# Altium project LowerPlumbingBayBoard.PrjPcb
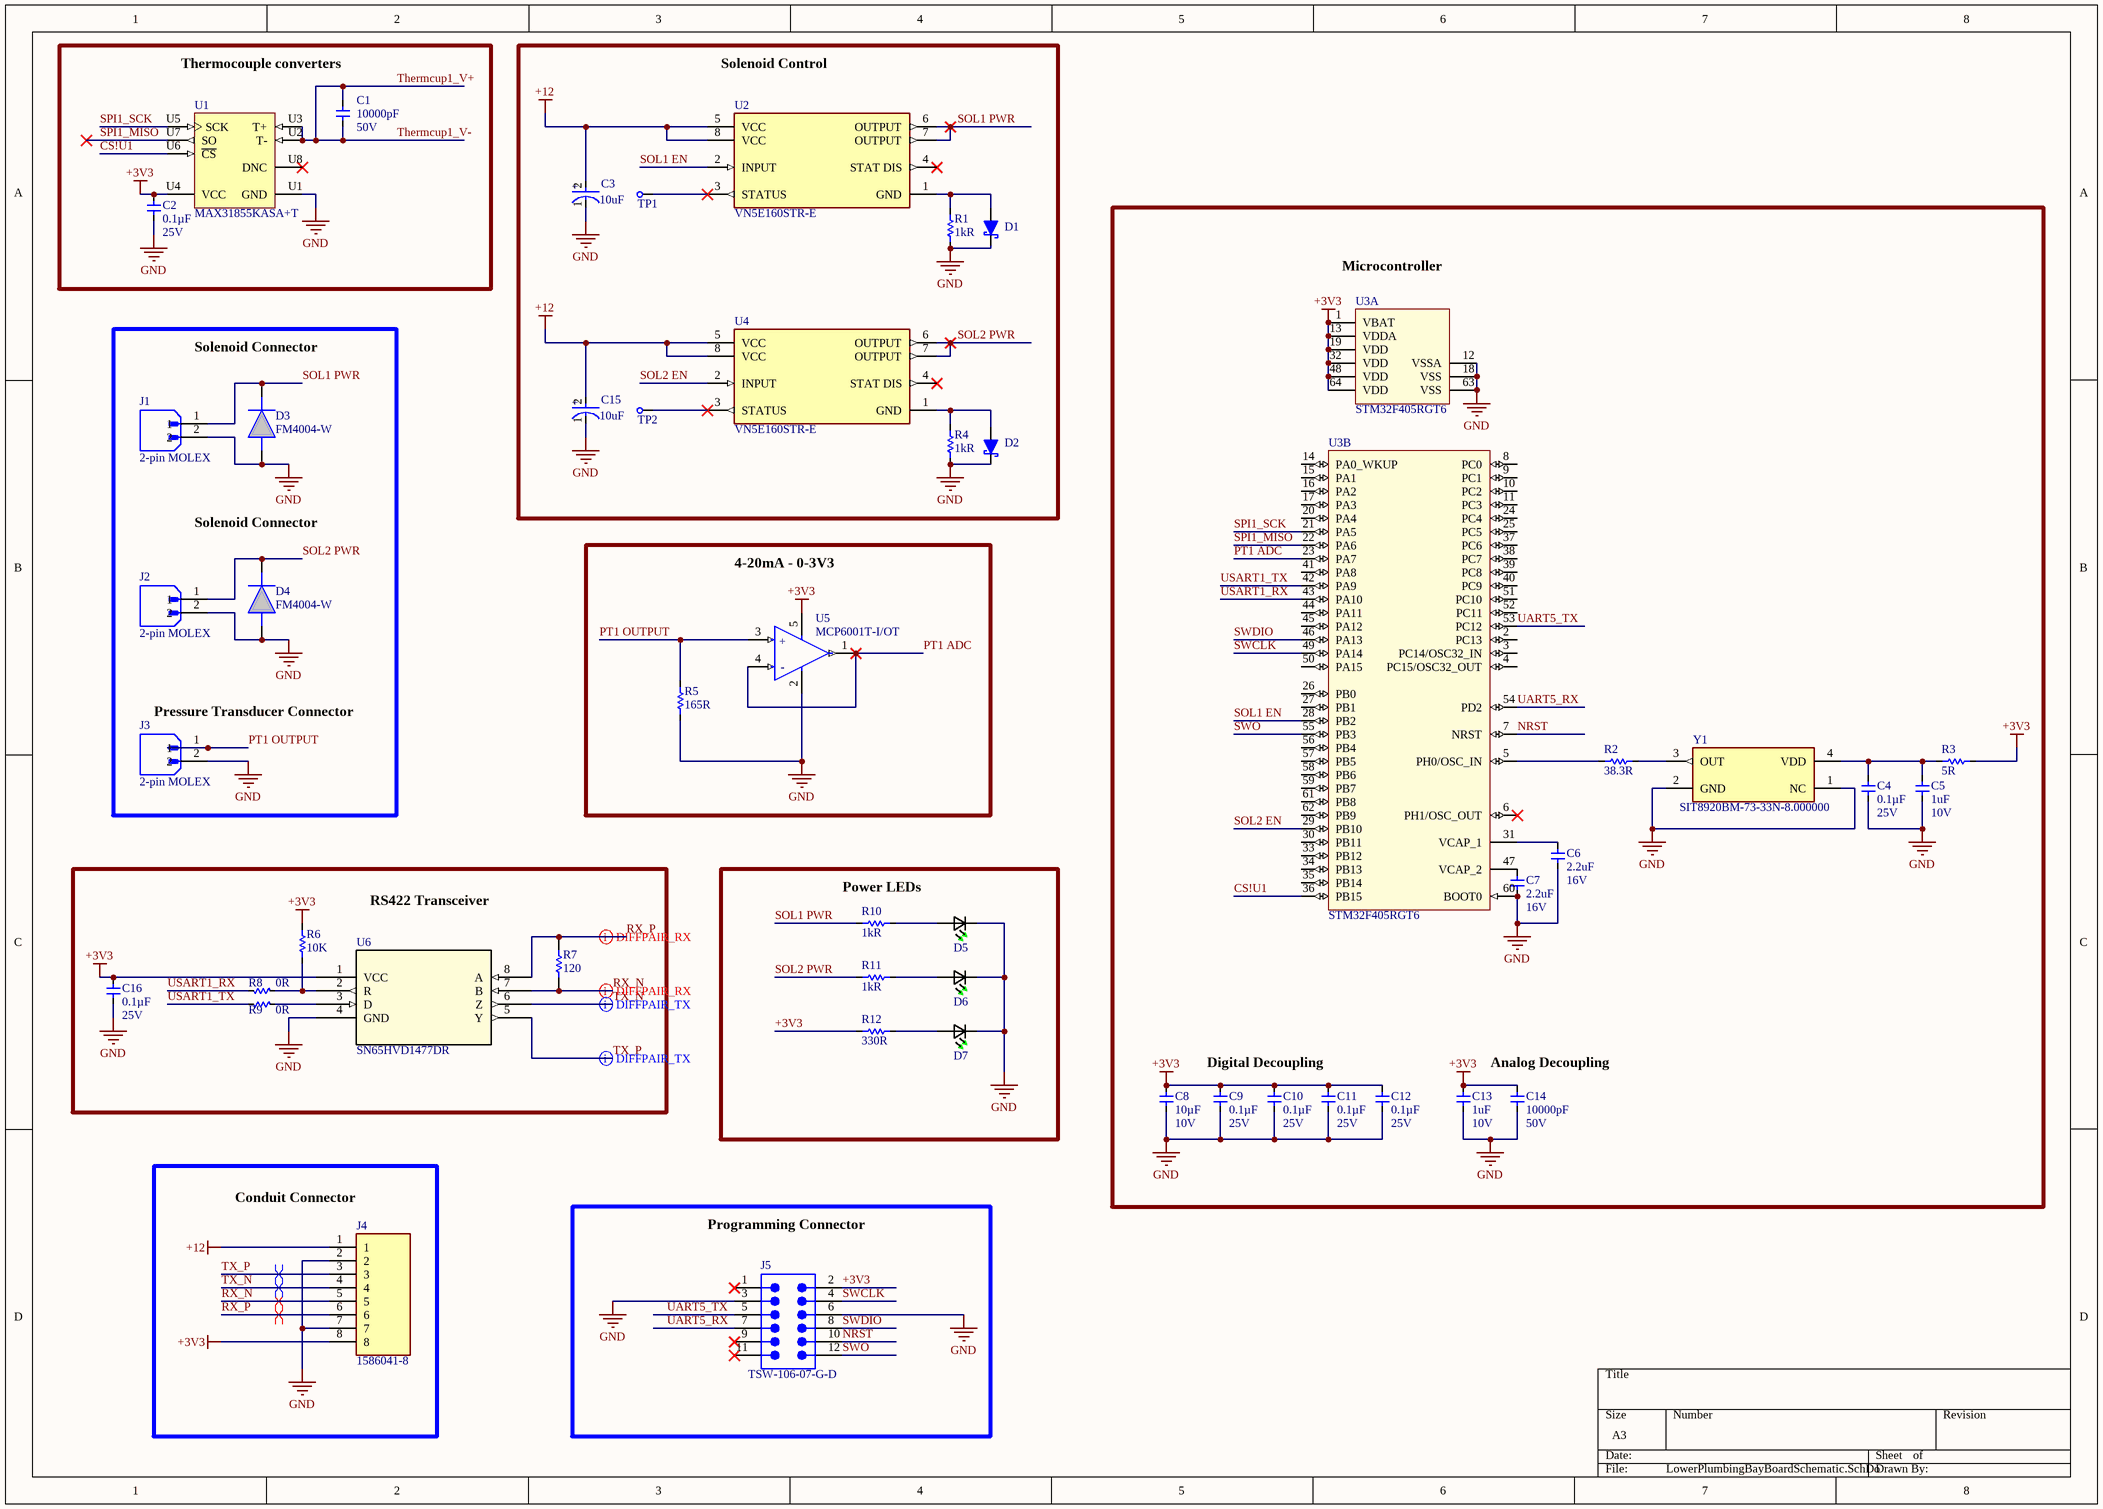
[diagram p0: LowerPlumbingBayBoardSchematic.SchDoc]
1 sheet, 49 parts. Net scope: global (net labels, ports and power ports of the same name join across sheets).
Board file: LowerPlumbingBayBoardPCB.PcbDoc

## Sheet LowerPlumbingBayBoardSchematic.SchDoc
size A3; SheetNumber: 1; SheetTotal: 1

### Parts
C1  Capacitance: 10000pF  Voltage - Rated: 50V  [10000pF-CAP_1608_TDK]  (hidden comment: CGA3E2X7R1H103K080AA)
C2  Capacitance: 0.1µF  Voltage - Rated: 25V  [0.1uF-FP-CGA3E-0_3-0_1-IPC_A]  (hidden comment: CGA3E2X7R1E104K080AA)
C3  Capacitance: 10uF  [FP-TAJB-MFG]  (hidden comment: TAJB106K025RNJ)
C4  Capacitance: 0.1µF  Voltage - Rated: 25V  [0603[1608]]  (hidden comment: CGA3E2X7R1E104K080AA)
C5  Capacitance: 1uF  Voltage - Rated: 10V  [0603[1608]]  (hidden comment: CL10A105KP8NNNC)
C6  Capacitance: 2.2uF  Voltage - Rated: 16V  [0603]  (hidden comment: C1608X5R1C225K080AB)
C7  Capacitance: 2.2uF  Voltage - Rated: 16V  [0603]  (hidden comment: C1608X5R1C225K080AB)
C8  Capacitance: 10µF  Voltage - Rated: 10V  [10uF-FP-CL10-IPC_B]  (hidden comment: CL10A106MP8NNNC)
C9  Capacitance: 0.1µF  Voltage - Rated: 25V  [0.1uF-FP-CGA3E-0_3-0_1-IPC_A]  (hidden comment: CGA3E2X7R1E104K080AA)
C10  Capacitance: 0.1µF  Voltage - Rated: 25V  [0.1uF-FP-CGA3E-0_3-0_1-IPC_A]  (hidden comment: CGA3E2X7R1E104K080AA)
C11  Capacitance: 0.1µF  Voltage - Rated: 25V  [0.1uF-FP-CGA3E-0_3-0_1-IPC_A]  (hidden comment: CGA3E2X7R1E104K080AA)
C12  Capacitance: 0.1µF  Voltage - Rated: 25V  [0.1uF-FP-CGA3E-0_3-0_1-IPC_A]  (hidden comment: CGA3E2X7R1E104K080AA)
C13  Capacitance: 1uF  Voltage - Rated: 10V  [1uF-FP-CL10-IPC_B]  (hidden comment: CL10A105KP8NNNC)
C14  Capacitance: 10000pF  Voltage - Rated: 50V  [10000pF-CAP_1608_TDK]  (hidden comment: CGA3E2X7R1H103K080AA)
C15  Capacitance: 10uF  [FP-TAJB-MFG]  (hidden comment: TAJB106K025RNJ)
C16  Capacitance: 0.1µF  Voltage - Rated: 25V  [0603]  (hidden comment: CGA3E2X7R1E104K080AA)
D1  B330A-13-F  [B330A-13-F]  (value not drawn)
D2  B330A-13-F  [B330A-13-F]  (value not drawn)
D3  FM4004-W  [DIONM5025X231N]
D4  FM4004-W  [DIONM5025X231N]
D5  LTST-C191KGKT  [LTST-C191KGKT]  (value not drawn)
D6  LTST-C191KGKT  [LTST-C191KGKT]  (value not drawn)
D7  LTST-C191KGKT  [LTST-C191KGKT]  (value not drawn)
J1  2-pin MOLEX  [MOLEX_436500227]
J2  2-pin MOLEX  [MOLEX_436500227]
J3  2-pin MOLEX  [MOLEX_436500227]
J4  1586041-8  [TE_1586041-8]
J5  TSW-106-07-G-D  [SMTC-TSW-106-07-X-D]
R1  Resistance: 1kR  [0603 - duplicate]  (hidden comment: RC0603FR-071KL)
R2  Resistance: 38.3R  [0603]  (hidden comment: ERJ-3EKF38R3V)
R3  Resistance: 5R  [BO_PWR2010]  (hidden comment: PWR2010W5R00JE)
R4  Resistance: 1kR  [0603 - duplicate]  (hidden comment: RC0603FR-071KL)
R5  Resistance: 165R  [0603]  (hidden comment: ERJ-3GEYJ103V)
R6  Resistance: 10K  [0603]  (hidden comment: ERJ-3GEYJ103V)
R7  120  [120ohm_RESC1608X55X30NL15T15]
R8  0R  [0603]
R9  0R  [0603]
R10  Resistance: 1kR  [0603 - duplicate]  (hidden comment: RC0603FR-071KL)
R11  Resistance: 1kR  [0603 - duplicate]  (hidden comment: RC0603FR-071KL)
R12  Resistance: 330R  [0603 - duplicate]  (hidden comment: CRGCQ0402J330R)
TP1  Testpoint  [Testpoint]  (value not drawn)  (no BOM)
TP2  Testpoint  [Testpoint]  (value not drawn)  (no BOM)
U1  MAX31855KASA+T  [MAXM-S8+4_L]
U2  VN5E160STR-E  [FP-SO-8-0016023-MFG]
U3  STM32F405RGT6  [STM-LQFP64_L]  (parts A,B of 2)
U4  VN5E160STR-E  [FP-SO-8-0016023-MFG]
U5  MCP6001T-I/OT  [FP-C04-091-OT-IPC_A]
U6  SN65HVD1477DR  [D8_TEX]
Y1  SIT8920BM-73-33N-8.000000  [FP-SIT8920BM-73-33N-8_000-MFG]

### Blocks framed on the sheet
Thermocouple converters: C1 C2 U1
Solenoid Control: C3 C15 D1 D2 R1 R4 TP1 TP2 U2 U4
4-20mA - 0-3V3: R5 U5
RS422 Transceiver: C16 R6-R9 U6
Power LEDs: D5-D7 R10-R12
Conduit Connector: J4
Programming Connector: J5

### Nets
+3V3: C2.1 C8.1 C9.1 C10.1 C11.1 C12.1 C13.1 C14.1 C16.1 J4.8 J5.2 R3.2 R6.2 R12.1 U1.U4(VCC) U3.1(VBAT) U3.13(VDDA) U3.19(VDD) U3.32(VDD) U3.48(VDD) U3.64(VDD) U5.5(VDD) U6.1(VCC)
+12: C3.2(A) C15.2(A) J4.1 U2.5(VCC) U2.8(VCC) U4.5(VCC) U4.8(VCC)
GND: C2.2 C3.1(C) C4.1 C5.1 C6.1 C7.2 C8.2 C9.2 C10.2 C11.2 C12.2 C13.2 C14.2 C15.1(C) C16.2 D1.2 D2.2 D3.2(A) D4.2(A) D5.1(K2) D6.1(K2) D7.1(K2) J1.2 J2.2 J3.2 J4.2 J4.7 J5.3 J5.6 R1.1 R4.1 R5.1 U1.U1(GND) U3.12(VSSA) U3.18(VSS) U3.60(BOOT0) U3.63(VSS) U5.2(VSS) U6.4(GND) Y1.1(NC) Y1.2(GND)
CS!U1: U1.U6(~{CS}) U3.36(PB15)
NRST: J5.10 U3.7(NRST)
PT1 ADC: U3.23(PA7) U5.1(VOUT) U5.4(VIN-)
PT1 OUTPUT: J3.1 R5.2 U5.3(VIN+)
RX_N: J4.5 R7.1 U6.7(B)
RX_P: J4.6 R7.2 U6.8(A)
SOL1 EN: U2.2(INPUT) U3.28(PB2)
SOL1 PWR: D3.1(K) J1.1 R10.1 U2.6(OUTPUT) U2.7(OUTPUT)
SOL2 EN: U3.29(PB10) U4.2(INPUT)
SOL2 PWR: D4.1(K) J2.1 R11.1 U4.6(OUTPUT) U4.7(OUTPUT)
SPI1_MISO: U1.U7(SO) U3.22(PA6)
SPI1_SCK: U1.U5(SCK) U3.21(PA5)
SWCLK: J5.4 U3.49(PA14)
SWDIO: J5.8 U3.46(PA13)
SWO: J5.12 U3.55(PB3)
Thermcup1_V+: C1.1 C1.2 U1.U2(T-) U1.U3(T+)  [also labelled Thermcup1_V-]
TX_N: J4.4 U6.6(Z)
TX_P: J4.3 U6.5(Y)
UART5_RX: J5.7 U3.54(PD2)
UART5_TX: J5.5 U3.53(PC12)
USART1_RX: R8.1 U3.43(PA10)
USART1_TX: R9.1 U3.42(PA9)
NetC4_2: C4.2 C5.2 R3.1 Y1.4(VDD)
NetC6_2: C6.2 U3.31(VCAP_1)
NetC7_1: C7.1 U3.47(VCAP_2)
NetD1_1: D1.1 R1.2 U2.1(GND)
NetD2_1: D2.1 R4.2 U4.1(GND)
NetD5_2: D5.2(A2) R10.2
NetD6_2: D6.2(A2) R11.2
NetD7_2: D7.2(A2) R12.2
NetR2_1: R2.1 U3.5(PH0/OSC_IN)
NetR2_2: R2.2 Y1.3(OUT)
NetR6_1: R6.1 R8.2 U6.2(R)
NetR9_2: R9.2 U6.3(D)
NetTP1_1: TP1.1 U2.3(STATUS)
NetTP2_1: TP2.1 U4.3(STATUS)

Not connected (* = marked no-connect by the designer): J5 1* 9* 11*; U1 U8(DNC)*; U2 4(STAT_DIS)*; U3 2(PC13) 3(PC14/OSC32_IN) 4(PC15/OSC32_OUT) 6(PH1/OSC_OUT)* 8(PC0) 9(PC1) 10(PC2) 11(PC3) 14(PA0_WKUP) 15(PA1) 16(PA2) 17(PA3) 20(PA4) 24(PC4) 25(PC5) 26(PB0) 27(PB1) 30(PB11) 33(PB12) 34(PB13) 35(PB14) 37(PC6) 38(PC7) 39(PC8) 40(PC9) 41(PA8) 44(PA11) 45(PA12) 50(PA15) 51(PC10) 52(PC11) 56(PB4) 57(PB5) 58(PB6) 59(PB7) 61(PB8) 62(PB9); U4 4(STAT_DIS)*

### Layout directives
differential pair: RX_N, RX_P, TX_N, TX_P

### Notes on the sheet
- (near U3) Microcontroller
- (near D3) Solenoid Connector
- Solenoid Connector
- (near J3) Pressure Transducer Connector
- (near R6) May need a termination resistor for reciver (need to match wires impedence)
- Digital Decoupling
- Analog Decoupling
- (in symbol CMP-0187-00462-3) +; -
- (in symbol CMP-04424-000481-1) +

### Library data of the parts
C1 C14 = CGA3E2X7R1H103K080AA: CAP CER 10000PF 50V X7R 0603; Manufacturer: TDK Corporation; Tolerance: ±10%; Temperature Coefficient: X7R; Operating Temperature: -55°C ~ 125°C; Mounting Type: Surface Mount, MLCC; Package / Case: 0603 (1608 Metric); Size / Dimension: 0.063" L x 0.031" W (1.60mm x 0.80mm); Manufacturer Part Number: CGA3E2X7R1H103K080AA; Thickness (Max): 0.035" (0.90mm); ComponentLink1Description: Datasheet; ComponentLink1URL: https://product.tdk.com/info/en/catalog/spec/mlccspec_automotive_general_en.pdf; Supplier 1: Digi-Key; Supplier Part Number 1: 445-5662-1-ND
C2 C4 C9-C12 C16 = CGA3E2X7R1E104K080AA: CAP CER 0.1UF 25V X7R 0603; Manufacturer: TDK Corporation; Tolerance: ±10%; Temperature Coefficient: X7R; Operating Temperature: -55°C ~ 125°C; Mounting Type: Surface Mount, MLCC; Package / Case: 0603 (1608 Metric); Size / Dimension: 0.063" L x 0.031" W (1.60mm x 0.80mm); Manufacturer Part Number: CGA3E2X7R1E104K080AA; Thickness (Max): 0.035" (0.90mm); ComponentLink1Description: Datasheet; ComponentLink1URL: https://product.tdk.com/info/en/catalog/spec/mlccspec_automotive_general_en.pdf; Supplier 1: Digi-Key; Supplier Part Number 1: 445-5667-1-ND
C3 C15 = CMP-04424-000481-1: 10uF 25V  ±10% 2.5Ω 1210  SMD Tantalum Capacitor; ESR (Equivalent Series Resistance): 2.5R; Polarity: Polar; Dissipation Factor: 6%; Leakage Current: 2.5uA; Lead Free: Lead Free; Voltage Rating: 25V; Mount: Surface Mount; Packaging: Tape and Reel; Min Operating Temperature: -55°C; Weight: 0.000564oz; Series: TAJ; Case/Package: 1210; Width: 0.11inch; Height - Seated (Max): 0.083inch; RoHS Compliant: Yes; Height: 2.1mm; Depth: 2.8mm; Radiation Hardening: No; Construction: Flat; Max Operating Temperature: 125°C; Voltage Rating (DC): 25V; Features: General Purpose; REACH SVHC: No SVHC; Tolerance: 10%; Package Quantity: 1; Case Code (Metric): 3528; Termination: SMD/SMT; Case Code (Imperial): 1210; Length: 3.5mm
C5 C13 = CL10A105KP8NNNC: CAP CER 1UF 10V X5R 0603; Manufacturer: Samsung Electro-Mechanics; Tolerance: ±10%; Temperature Coefficient: X5R; Operating Temperature: -55°C ~ 85°C; Mounting Type: Surface Mount, MLCC; Package / Case: 0603 (1608 Metric); Size / Dimension: 0.063" L x 0.031" W (1.60mm x 0.80mm); Manufacturer Part Number: CL10A105KP8NNNC; Thickness (Max): 0.035" (0.90mm); ComponentLink1Description: Datasheet; ComponentLink1URL: http://www.samsungsem.com/kr/support/product-search/mlcc/__icsFiles/afieldfile/2019/05/10/19-CL10A105KP8NNNC.pdf; Supplier 1: Digi-Key; Supplier Part Number 1: 1276-1182-1-ND
C6 C7 = C1608X5R1C225K080AB: CAP CER 2.2UF 16V X5R 0603; Manufacturer: TDK Corporation; Tolerance: ±10%; Temperature Coefficient: X5R; Operating Temperature: -55°C ~ 85°C; Mounting Type: Surface Mount, MLCC; Package / Case: 0603 (1608 Metric); Size / Dimension: 0.063" L x 0.031" W (1.60mm x 0.80mm); Manufacturer Part Number: C1608X5R1C225K080AB; Thickness (Max): 0.035" (0.90mm); ComponentLink1Description: Datasheet; ComponentLink1URL: https://product.tdk.com/info/en/catalog/spec/mlccspec_commercial_general_midvoltage_en.pdf; Supplier 1: Digi-Key; Supplier Part Number 1: 445-5157-1-ND
C8 = CL10A106MP8NNNC: CAP CER 10UF 10V X5R 0603; Manufacturer: Samsung Electro-Mechanics; Tolerance: ±20%; Temperature Coefficient: X5R; Operating Temperature: -55°C ~ 85°C; Mounting Type: Surface Mount, MLCC; Package / Case: 0603 (1608 Metric); Size / Dimension: 0.063" L x 0.031" W (1.60mm x 0.80mm); Manufacturer Part Number: CL10A106MP8NNNC; Thickness (Max): 0.035" (0.90mm); ComponentLink1Description: Datasheet; ComponentLink1URL: https://static6.arrow.com/aropdfconversion/f91a1722e2705c3d73cfb1979021b64ae4055093/19-cl10a106mp8nnnc.pdf; Supplier 1: Digi-Key; Supplier Part Number 1: 1276-1871-1-ND
D1 D2 = B330A-13-F: DIODE SCHOTTKY 30V 3A SMA; Manufacturer: Diodes Incorporated; Voltage - Forward (Vf) (Max) @ If: 500mV @ 3A; 500mV @ 3A: Fast Recovery =< 500ns, > 200mA (Io); Current - Reverse Leakage @ Vr: 500µA @ 30V; Capacitance @ Vr, F: 200pF @ 4V, 1MHz; ComponentLink1Description: Datasheet; ComponentLink1URL: https://www.diodes.com/assets/Datasheets/ds30891.pdf; Manufacturer Part Number: B330A-13-F; Type: Schottky; Supplier 1: Digi-Key; Supplier Part Number 1: B330A-FDICT-ND; Voltage - DC Reverse (Vr) (Max): 30V; Current - Average Rectified (Io): 3A; Mounting Type: Surface Mount; Package / Case: DO-214AC, SMA; Operating Temperature - Junction: -55°C ~ 150°C
D3 D4 = FM4004-W: Rectifiers 1N4004 1A 400V; Manufacturer_Name: Rectron; Geometry.Height: 2.31mm; Mouser Part Number: 583-FM4004; Mouser Price/Stock: https://www.mouser.co.uk/ProductDetail/Rectron/FM4004-W?qs=Iw9Ubr57Px3IHNH1bE4l9w%3D%3D; Manufacturer_Part_Number: FM4004-W; Datasheet Link: https://componentsearchengine.com/Datasheets/1/FM4004-W.pdf
D5-D7 = LTST-C191KGKT: LED,  LTST-C191KGKT; Manufacturer: Vishay Lite-On; Color: Green; Lens Color: Colorless; Luminous Intensity: 35mcd; Viewing Angle: 130°; Forward Voltage: 2V; Dominant Wavelength: 571nm; Test Current: 20mA; Lens Transparency: Clear; Wavelength: 574nm; Lens Style: Flat,Rectangular,Colorless; Number of LEDs: 1; Max Power Dissipation: 75mW; Lens Size: 0.8mm; Supplier 1: Arrow Electronics; Supplier Part Number 1: LTST-C191KGKT; Manufacturer Part Number: LTST-C191KGKT; RoHS: Yes; Category: Uncategorized; Stock: 3111; Pricing: 1=0.223, 10=0.1424, 25=0.1365, 100=0.0663, 250=0.0656, 500=0.0612, 1000=0.0451, 2000=0.0464, 3000=0.0448, 5000=0.0403, 10000=0.0363, 25000=0.0323, 50000=0.0316 (USD); Mount: Surface Mount; Case/Package: 0603; Number of Pins: 2; Case Code (Metric): 1608; Case Code (Imperial): 0603; Min Operating Temperature: -55°C; Max Operating Temperature: 85°C; Packaging: Tape and Reel; Series: -; Length: 1.6mm; Width: 0.8mm; Height: 0.65mm; RoHS Compliant: Yes; Lead Free: Lead Free; ComponentLink1URL: https://datasheet.ciiva.com/2109/ltst-c191kgkt-2109973.pdf?src-supplier=Digi-Key; ComponentLink1Description: https://datasheet.ciiva.com/2109/ltst-c191kgkt-2109973.pdf?src-supplier=Digi-Key
J1-J3 = 2-pin MOLEX: MP: 436500227; Value: *; Package: None; Price: None; Availability: Unavailable
J4 = 1586041-8: Connector Header Through Hole, Right Angle 8 position 0.165 (4.20mm); MF: TE Connectivity; Purchase-URL: https://pricing.snapeda.com/search/part/1586041-8/?ref=eda; Digi-Key_Part_Number: A30617-ND; Package: None; Value: *; MP: 1586041-8; EU_RoHS_Compliance: Compliant; Check_prices: https://www.snapeda.com/parts/1586041-8/TE%20Connectivity%20AMP%20Connectors/view-part/2366268/?ref=eda; SnapEDA_Link: https://www.snapeda.com/parts/1586041-8/TE%20Connectivity%20AMP%20Connectors/view-part/2366268/?ref=snap
J5 = SMTC-TSW-106-07-X-D_1: 0.025" SQ Post Header, Through-hole, Vertical, -55 to 125 degC, 2.54 mm Pitch, 12-Pin, Male, RoHS; Manufacturer: Samtec; Pitch: 2.54 mm; ComponentLink1URL: http://www.samtec.com; DatasheetVersion: F-214; ComponentLink3URL: http://www.samtec.com/documents/webfiles/cpdf/TSW-XXX-XX-XXX-X-XX-XXX-MKT.pdf; PackageVersion: DM, 8/1988; Mounting Technology: Through-hole; ComponentLink1Description: Manufacturer URL; Orientation: Vertical; PackageDescription: .025[0.64] SQ. Post Terminal Strip Assembly; ComponentLink2URL: http://www.samtec.com/documents/webfiles/pdf/TSW_TH.PDF; RoHS: True; ComponentLink3Description: Package Specification; ComponentLink2Description: Datasheet; PackageReference: TSW-106-07-X-D; Temperature Range: -55 to 125 degC; PartNumber: TSW-106-07-G-D
R1 R4 R10 R11 = RC0603FR-071KL: Res Thick Film 0603 1K Ohm 1% 1/10W ±100ppm/°C Molded SMD SMD Paper T/R; Manufacturer: Yageo; Power Rating: 100mW; Voltage Rating: 50V; Tolerance: 1%; Temperature Coefficient: 100ppm/°C; Manufacturer Part Number: RC0603FR-071KL; ComponentLink1Description: https://datasheet.ciiva.com/11808/0900766b80f96399-11808081.pdf?src-supplier=Rs; ComponentLink1URL: https://datasheet.ciiva.com/11808/0900766b80f96399-11808081.pdf?src-supplier=Rs; Supplier 1: Future Electronics; Supplier Part Number 1: 4016291; RoHS: Yes; Category: Chip SMD Resistors; Stock: 11600000; Pricing: 5000=0.0015, 50000=0.0014, 200000=0.0014, 625000=0.0013, 2000000=0.0012 (USD); Case/Package: 0603; Contact Plating: Tin,Matte; Case Code (Imperial): 0603; Case Code (Metric): 1608; Size Code: 0603; Min Operating Temperature: -55°C; Max Operating Temperature: 155°C; Resistor Type: Thick Film; Packaging: Tape and Reel; Termination: SMD/SMT; Features: Moisture Resistant; Series: RC; Max Power Dissipation: 100mW; Number of Terminations: 2; Technology: THICK FILM; Resistance Tolerance: 1%; Construction: Rectangular; Length: 1.6mm; Height: 0.45mm; Depth: 0.8mm; Reach SVHC Compliant: No; Military Standard: Not; Lead Free: Lead Free; RoHS Compliant: Yes; ComponentLink2URL: https://datasheet.ciiva.com/7746/1686128-7746280.pdf?src-supplier=Element14; ComponentLink2Description: https://datasheet.ciiva.com/7746/1686128-7746280.pdf?src-supplier=Element14; ComponentLink3URL: https://datasheet.ciiva.com/7660/1868787-7660790.pdf?src-supplier=Element14; ComponentLink3Description: https://datasheet.ciiva.com/7660/1868787-7660790.pdf?src-supplier=Element14; ComponentLink4URL: https://datasheet.ciiva.com/7983/443971-7983613.pdf?src-supplier=Element14; ComponentLink4Description: https://datasheet.ciiva.com/7983/443971-7983613.pdf?src-supplier=Element14; ComponentLink5URL: https://datasheet.ciiva.com/7746/1738695-7746281.pdf?src-supplier=Element14; ComponentLink5Description: https://datasheet.ciiva.com/7746/1738695-7746281.pdf?src-supplier=Element14; ComponentLink6URL: https://datasheet.ciiva.com/7746/1738695-7746279.pdf?src-supplier=Element14; ComponentLink6Description: https://datasheet.ciiva.com/7746/1738695-7746279.pdf?src-supplier=Element14; ComponentLink7URL: https://datasheet.ciiva.com/8896/pyu-rc0603-51-rohs-l-4-8896106.pdf?src-supplier=Avnet; ComponentLink7Description: https://datasheet.ciiva.com/8896/pyu-rc0603-51-rohs-l-4-8896106.pdf?src-supplier=Avnet; ComponentLink8URL: https://datasheet.ciiva.com/15189/getdatasheetpartid-404327-15189644.pdf?src-supplier=Verical; ComponentLink8Description: https://datasheet.ciiva.com/15189/getdatasheetpartid-404327-15189644.pdf?src-supplier=Verical
R2 = ERJ-3EKF38R3V: Res Thick Film 0603 38.3 Ohm 1% 1/10W ±100ppm/°C Molded SMD Punched Carrier T/R; Manufacturer: Panasonic; Power Rating: 100mW; Voltage Rating: 75V; Voltage Rating (DC): 50V; Supplier 1: Newark; Supplier Part Number 1: 01AC1806; Manufacturer Part Number: ERJ-3EKF38R3V; RoHS: Yes; Category: Chip SMD Resistors; Stock: 83770; Pricing: 10=0.04200, 25=0.03500, 50=0.02700, 100=0.01800 (CAD); Mount: Surface Mount; Case/Package: 0603; Case Code (Metric): 1608; Case Code (Imperial): 0603; Weight: 7.1E-05oz; Contact Plating: Tin; Min Operating Temperature: -55°C; Max Operating Temperature: 155°C; Packaging: Tape and Reel; Tolerance: 1%; Package Quantity: 1; Resistor Type: Thick Film; Number of Terminations: 2; Termination: SMD/SMT; Temperature Coefficient: 100ppm/°C; Max Power Dissipation: 100mW; Features: Automotive AEC-Q200; Series: ERJ; Construction: Rectangular; Resistance Tolerance: 1%; Length: 0.063inch; Width: 0.8mm; Height: 0.022inch; Depth: 0.8mm; Reach SVHC Compliant: Yes; Military Standard: Not; Lead Free: Lead Free; RoHS Compliant: Yes; ComponentLink1URL: https://datasheet.ciiva.com/22760/1678782-22760701.pdf?src-supplier=Farnell; ComponentLink1Description: https://datasheet.ciiva.com/22760/1678782-22760701.pdf?src-supplier=Farnell; ComponentLink2URL: https://datasheet.ciiva.com/22741/1678782-22741961.pdf?src-supplier=Element14; ComponentLink2Description: https://datasheet.ciiva.com/22741/1678782-22741961.pdf?src-supplier=Element14; ComponentLink3URL: https://datasheet.ciiva.com/24165/aoa0000ce2-24165276.pdf?src-supplier=Mouser; ComponentLink3Description: https://datasheet.ciiva.com/24165/aoa0000ce2-24165276.pdf?src-supplier=Mouser
R3 = PWR2010W5R00JE: Res Wirewound 2010 5 Ohm 5% 1/2W ±50ppm/°C Molded SMD SMD T/R; Manufacturer: Bourns; Power Rating: 500mW; Threshold Voltage: 1.6V; Supplier 1: Newark; Supplier Part Number 1: 05R8093; Manufacturer Part Number: PWR2010W5R00JE; RoHS: Yes; Category: Chip SMD Resistors; Stock: 26; Pricing: 1=0.68700, 10=0.68700, 25=0.68700, 50=0.68700, 100=0.68700, 250=0.68700 (CAD); Mount: Surface Mount; Case/Package: 2010; Number of Pins: 2; Case Code (Metric): 5025; Case Code (Imperial): 2010; Min Operating Temperature: -55°C; Max Operating Temperature: 155°C; Tolerance: 5%; Resistor Type: Wirewound; Temperature Coefficient: 50ppm/°C; Packaging: Cut Tape; Package Quantity: 1; Number of Terminations: 2; Termination: Solder; Max Power Dissipation: 500mW; Series: PWR2010; Resistance Tolerance: 5%; Technology: WIRE WOUND; Length: 0.2inch; Width: 0.1inch; Height: 0.148inch; Depth: 2.54mm; Reach SVHC Compliant: Yes; Military Standard: Not; ComponentLink1URL: https://datasheet.ciiva.com/7986/1727932-7986277.pdf?src-supplier=Element14; ComponentLink1Description: https://datasheet.ciiva.com/7986/1727932-7986277.pdf?src-supplier=Element14; ComponentLink2URL: https://datasheet.ciiva.com/22713/1727932-22713400.pdf?src-supplier=Element14; ComponentLink2Description: https://datasheet.ciiva.com/22713/1727932-22713400.pdf?src-supplier=Element14; ComponentLink3URL: https://datasheet.ciiva.com/9122/pwr2010-9122735.pdf?src-supplier=Avnet; ComponentLink3Description: https://datasheet.ciiva.com/9122/pwr2010-9122735.pdf?src-supplier=Avnet; ComponentLink4URL: https://datasheet.ciiva.com/15865/pwr2010-15865624.pdf?src-supplier=Onlinecomponents.com; ComponentLink4Description: https://datasheet.ciiva.com/15865/pwr2010-15865624.pdf?src-supplier=Onlinecomponents.com; ComponentLink5URL: https://datasheet.ciiva.com/2484/pwr2010-2484257.pdf?src-supplier=Digi-Key; ComponentLink5Description: https://datasheet.ciiva.com/2484/pwr2010-2484257.pdf?src-supplier=Digi-Key; ComponentLink6URL: https://datasheet.ciiva.com/2484/pwr2010-2484258.pdf?src-supplier=Digi-Key; ComponentLink6Description: https://datasheet.ciiva.com/2484/pwr2010-2484258.pdf?src-supplier=Digi-Key; ComponentLink7URL: https://datasheet.ciiva.com/2484/pwr2010-2484256.pdf?src-supplier=Digi-Key; ComponentLink7Description: https://datasheet.ciiva.com/2484/pwr2010-2484256.pdf?src-supplier=Digi-Key
R5 R6 = ERJ-3GEYJ103V: RES SMD 10K OHM 5% 1/10W 0603; Manufacturer: Panasonic Electronic Components; Power  (W): 0.1W; Temperature Coefficient: ±200ppm/°C; Package: 0603 (1608 Metric); Tolerance: ±5%; Operating Temperature: -55°C ~ 155°C; Composition: Thick Film; Manufacturer Part Number: ERJ-3GEYJ103V; ComponentLink1Description: Datasheet; ComponentLink1URL: https://industrial.panasonic.com/cdbs/www-data/pdf/RDA0000/DMA0000COL11.pdf; Supplier 1: Digi-Key; Supplier Part Number 1: P10KGCT-ND; ComponentLink2Description: Land Pattern; ComponentLink2URL: https://industrial.panasonic.com/cdbs/www-data/pdf/RDA0000/DMA0000COL17.pdf
R7 = 120OHM_0.1W_RES_1: ERJ-3GEYJ121V  Res Thick Film 0603 120 Ohm 5% 1/10W +/-200ppm/ßC Molded SMD Punched Carrier T/R; Manufacturer: Panasonic; Part Number: ERJ-3GEYJ121V
R8 R9 = RT-0R00-F-1/10W-0603: 0 Ohms Jumper 0.1W, 1/10W Chip Resistor 0603 (1608 Metric) Automotive AEC-Q200 Thick Film; Manufacturer: Stackpole Electronics Inc; Manufacturer Part #: RMCF0603ZT0R00; ComponentLink1description: Datasheet; ComponentLink1URL: https://industrial.panasonic.com/ww/products/resistors/chip-resistors/general-purpose-chip-resistors/models/ERJ2GE0R00X; ComponentLink2description: Manufacturer Website; Distributor: Digikey; Distributor Part #: RMCF0603ZT0R00CT-ND; Part Description: 0 Ohms Jumper 0.1W, 1/10W Chip Resistor 0603 (1608 Metric) Automotive AEC-Q200 Thick Film; ComponentLink2URL: https://industrial.panasonic.com/ww/products/resistors/chip-resistors/general-purpose-chip-resistors/models/ERJ2GE0R00X; Value: 0R
R12 = CRGCQ0402J330R: Res Thick Film 0402 330 Ohm 5% 0.063W(1/16W) ±100ppm/C Pad SMD Automotive T/R; Manufacturer: TE Connectivity; Max Power Dissipation: 63mW; Temperature Coefficient: 100ppm/°C; Supplier 1: Arrow Electronics; Supplier Part Number 1: CRGCQ0402J330R; Manufacturer Part Number: CRGCQ0402J330R; RoHS: Yes; Category: Chip SMD Resistors; Stock: 20410; Pricing: 1=0.0576, 10=0.0086, 100=0.0034, 250=0.0033, 500=0.0032, 1000=0.0018, 3000=0.0017, 6000=0.0016, 15000=0.0015 (USD); Case/Package: 0402; Case Code (Imperial): 0402; Case Code (Metric): 1005; Min Operating Temperature: -55°C; Max Operating Temperature: 155°C; Features: Moisture Resistant,Automotive AEC-Q200; Packaging: Cut Tape; Tolerance: 5%; Number of Terminations: 2; Series: CRGCQ; Ratings: AEC-Q200; RoHS Compliant: Yes; ComponentLink1URL: https://4donline.ihs.com/images/VipMasterIC/IC/TYEL/TYEL-S-A0004929575/TYEL-S-A0004929575-1.pdf?hkey=52A5661711E402568146F3353EA87419&src-supplier=Newark; ComponentLink1Description: https://4donline.ihs.com/images/VipMasterIC/IC/TYEL/TYEL-S-A0004929575/TYEL-S-A0004929575-1.pdf?hkey=52A5661711E402568146F3353EA87419&src-supplier=Newark; ComponentLink2URL: https://www.te.com/commerce/DocumentDelivery/DDEController?Action=srchrtrv&amp;DocNm=1773204-3&amp;DocType=DS&amp;DocLang=English&src-supplier=Digi-Key; ComponentLink2Description: https://www.te.com/commerce/DocumentDelivery/DDEController?Action=srchrtrv&amp;DocNm=1773204-3&amp;DocType=DS&amp;DocLang=English&src-supplier=Digi-Key; ComponentLink3URL: https://4donline.ihs.com/images/VipMasterIC/IC/TYEL/TYEL-S-A0004929575/TYEL-S-A0004929575-1.pdf?hkey=52A5661711E402568146F3353EA87419&src-supplier=Farnell; ComponentLink3Description: https://4donline.ihs.com/images/VipMasterIC/IC/TYEL/TYEL-S-A0004929575/TYEL-S-A0004929575-1.pdf?hkey=52A5661711E402568146F3353EA87419&src-supplier=Farnell
TP1 TP2 = Testpoint: TESTPOINT 0.7MMD Hole, 1.2MMW, 1.2MML
U1 = MAX31855-S8+4_1: Cold Junction Compensated Thermocouple to Digital Converter, 14 Bits Temperature Resolution, -40 to 125 degC, 8-Pin SOIC (S8+4), Pb-Free, Tape ang Reel; Interface: SPI; Parasite Pwr.: No; Functions: Thermocouple-to-Digital Converter; ComponentLink3Description: Package Specification; DatasheetVersion: Rev. 2; Generic Part Number: MAX31855; PartNumber: MAX31855KASA+T; PackageReference: S8+4; ComponentLink3URL: http://pdfserv.maximintegrated.com/package_dwgs/21-0041.PDF; Code_JEDEC: MS-012; Packing: Tape ang Reel; PackageDescription: 8-Pin Small-Outline IC, Narrow, Body 3.9 x 4.9 mm, Pitch 1.27 mm; Mounting Technology: Surface Mount; ComponentLink1URL: http://www.maximintegrated.com/; PackageVersion: Rev. D, 10/2012; ComponentLink2URL: http://datasheets.maximintegrated.com/en/ds/MAX31855.pdf; ComponentLink1Description: Manufacturer URL; ComponentLink2Description: Datasheet
U2 U4 = VN5E160STR-E: Single channel high side driver for automotive applications in a SO-8 package.; Manufacturer: STMicroelectronics; Max Supply Voltage: 28V; Min Supply Voltage: 4.5V; Number of Outputs: 1; Max Supply Current: 3.5mA; Max Output Current: 10A; Operating Supply Voltage: 13V; On-State Resistance: 160mR; Output Current per Channel: 7A; Turn-Off Delay Time: 15us; Turn-On Delay Time: 10us; Supplier 1: RSComponents; Supplier Part Number 1: 1906863P; Manufacturer Part Number: VN5E160STR-E; RoHS: Yes; Category: Hot Swap Controllers; Stock: 7410; Pricing: 50=1.40400, 100=1.33000, 250=1.25500, 500=1.19700 (GBP); Mount: Surface Mount; Case/Package: SOIC; Number of Pins: 8; Min Operating Temperature: -40°C; Max Operating Temperature: 150°C; Packaging: Tape and Reel; Package Quantity: 2500; Output Current: 10A; Nominal Supply Current: 3.5mA; Number of Drivers: 1; Series: VIPower™; Supply Current: 3.5mA; Radiation Hardening: No; Lead Free: Lead Free; RoHS Compliant: Yes; ComponentLink1URL: https://datasheet.ciiva.com/12213/cd00161993-115163-12213649.pdf?src-supplier=Mouser; ComponentLink1Description: https://datasheet.ciiva.com/12213/cd00161993-115163-12213649.pdf?src-supplier=Mouser; ComponentLink2URL: https://datasheet.ciiva.com/16510/cd00161993-16510912.pdf?src-supplier=Future+Electronics; ComponentLink2Description: https://datasheet.ciiva.com/16510/cd00161993-16510912.pdf?src-supplier=Future+Electronics; ComponentLink3URL: https://datasheet.ciiva.com/1956/cd00161993-1956305.pdf?src-supplier=Digi-Key; ComponentLink3Description: https://datasheet.ciiva.com/1956/cd00161993-1956305.pdf?src-supplier=Digi-Key
U3 = STM32F405RGT6: IC MCU 32BIT 1MB FLASH 64LQFP; Manufacturer: STMicroelectronics; Core Processor: ARM® Cortex®-M4; Core Size: 32-Bit; Speed: 168MHz; Connectivity: CANbus, I²C, IrDA, LINbus, SPI, UART/USART, USB OTG; Peripherals: Brown-out Detect/Reset, DMA, I²S, LCD, POR, PWM, WDT; Number of I/O: 51; Program Memory Size: 1MB (1M x 8); RAM Size: 192K x 8; Voltage - Supply (VDD): 1.8V ~ 3.6V; Data Converters: A/D 16x12b; D/A 2x12b; Oscillator Type: Internal; ComponentLink1Description: Datasheet; ComponentLink1URL: https://www.st.com/content/ccc/resource/technical/document/datasheet/ef/92/76/6d/bb/c2/4f/f7/DM00037051.pdf/files/DM00037051.pdf/jcr:content/translations/en.DM00037051.pdf; Program Memory Type: FLASH; Manufacturer Part Number: STM32F405RGT6; Operating Temperature: -40°C ~ 85°C (TA); Mounting Type: Surface Mount; Package / Case: 64-LQFP; Supplier 1: Digi-Key; Supplier Part Number 1: 497-11767-ND
U5 = CMP-0187-00462-3: IC OPAMP GP 1 CIRCUIT SOT23-5; Number of Amplifiers: 1; Voltage: 6V; Power Supply Rejection Ratio (PSRR): 86dB; Common Mode Rejection Ratio: 60dB; Unity Gain Bandwidth Product: 1MHz; Slew Rate: 0.6V/µs; Output Current per Channel: 23mA; Nominal Supply Current: 100uA; Input Offset Voltage (Vos): 4.5mV; Input Bias Current: 1pA; Operating Supply Voltage: 5.5V; Min Supply Voltage: 1.8V; Voltage Gain: 112dB; Length: 3.1mm; REACH SVHC: No SVHC; Number of Pins: 5; Package Quantity: 1; Radiation Hardening: No; Mount: Surface Mount; Number of Circuits: 1; Number of Elements: 1; Output Current: 23mA; Packaging: Tape and Reel; Height: 1.3mm; Lead Free: Lead Free; Min Operating Temperature: -40°C; Bandwidth: 1MHz; Contact Plating: Tin; Max Supply Voltage: 6V; Max Operating Temperature: 85°C; Width: 1.8mm; Case/Package: SOT-23; Operating Supply Current: 100uA; Number of Channels: 1; Gain Bandwidth Product: 1MHz
U6 = SN65HVD1477DR: No Description Available; Mfr_Name: Texas Instruments; Copyright: Copyright (C) 2022 Ultra Librarian. All rights reserved.; Manufacturer_Part_Number: SN65HVD1477DR; RefDes: RefDes; Type: DEV
Y1 = CMP-25149-000010-1: MEMS OSC XO 8.0000MHZ LVCM LVTTL